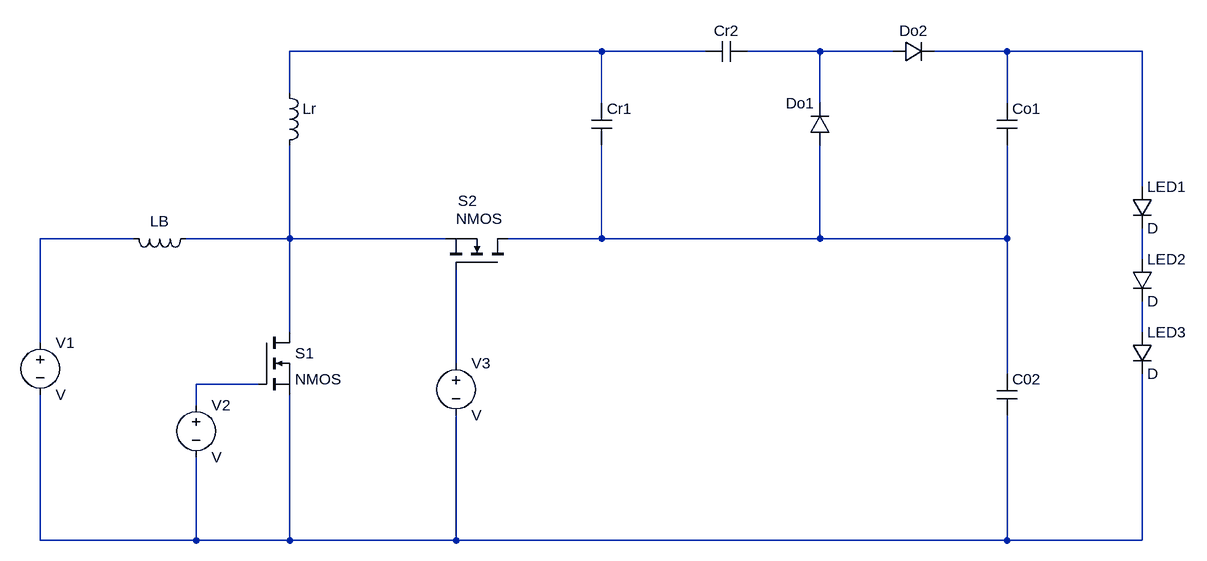
[diagram p0: schematic ideale.asc]
ideale.asc, the LTspice schematic file:
Version 4.1
SHEET 1 1256 680
WIRE 352 -128 -128 -128
WIRE 512 -128 352 -128
WIRE 688 -128 576 -128
WIRE 800 -128 688 -128
WIRE 976 -128 864 -128
WIRE 1184 -128 976 -128
WIRE -128 -64 -128 -128
WIRE 352 -48 352 -128
WIRE 688 -48 688 -128
WIRE 976 -48 976 -128
WIRE 1184 80 1184 -128
WIRE -368 160 -512 160
WIRE -128 160 -128 16
WIRE -128 160 -288 160
WIRE 112 160 -128 160
WIRE 352 160 352 16
WIRE 352 160 208 160
WIRE 688 160 688 16
WIRE 688 160 352 160
WIRE 976 160 976 16
WIRE 976 160 688 160
WIRE 1184 192 1184 144
WIRE -128 304 -128 160
WIRE 1184 304 1184 256
WIRE -512 320 -512 160
WIRE 128 352 128 208
WIRE 976 368 976 160
WIRE -176 384 -272 384
WIRE -272 416 -272 384
WIRE -512 624 -512 400
WIRE -272 624 -272 496
WIRE -272 624 -512 624
WIRE -128 624 -128 400
WIRE -128 624 -272 624
WIRE 128 624 128 432
WIRE 128 624 -128 624
WIRE 976 624 976 432
WIRE 976 624 128 624
WIRE 1184 624 1184 368
WIRE 1184 624 976 624
SYMBOL cap 336 -48 R0
SYMATTR InstName Cr1
SYMATTR Value ""
SYMBOL cap 576 -144 R90
WINDOW 0 0 32 VBottom 2
WINDOW 3 32 32 VTop 2
SYMATTR InstName Cr2
SYMATTR Value ""
SYMBOL diode 704 16 R180
WINDOW 0 24 64 Left 2
WINDOW 3 24 0 Left 2
SYMATTR InstName Do1
SYMATTR Value ""
SYMBOL diode 800 -112 R270
WINDOW 0 32 32 VTop 2
WINDOW 3 0 32 VBottom 2
SYMATTR InstName Do2
SYMATTR Value ""
SYMBOL cap 960 -48 R0
SYMATTR InstName Co1
SYMATTR Value ""
SYMBOL cap 960 368 R0
SYMATTR InstName C02
SYMATTR Value ""
SYMBOL diode 1168 80 R0
SYMATTR InstName LED1
SYMBOL diode 1168 192 R0
SYMATTR InstName LED2
SYMBOL diode 1168 304 R0
SYMATTR InstName LED3
SYMBOL nmos -176 304 R0
SYMATTR InstName S1
SYMBOL nmos 208 208 M270
WINDOW 0 106 77 VLeft 2
WINDOW 3 79 80 VLeft 2
SYMATTR InstName S2
SYMBOL ind -144 -80 R0
SYMATTR InstName Lr
SYMATTR Value ""
SYMBOL ind -272 144 R90
WINDOW 0 5 56 VBottom 2
WINDOW 3 32 56 VTop 2
SYMATTR InstName LB
SYMATTR Value ""
SYMBOL voltage -512 304 R0
SYMATTR InstName V1
SYMBOL voltage -272 400 R0
SYMATTR InstName V2
SYMBOL voltage 128 336 R0
SYMATTR InstName V3

The netlist it stands for:
* ideale.asc
Cr1 N001 N006
Cr2 N002 N001
Do1 N006 N002
Do2 N002 N003
Co1 N003 N006
C02 N006 N011
D§LED1 N003 N007 D
D§LED2 N007 N008 D
D§LED3 N008 N011 D
M§S1 N005 N010 N011 N011 NMOS
M§S2 N006 N009 N005 N005 NMOS
Lr N001 N005
LB N005 N004
V1 N004 N011 V
V2 N010 N011 V
V3 N009 N011 V
.model D D
.lib standard.dio
.model NMOS NMOS
.model PMOS PMOS
.lib standard.mos
.backanno
.end